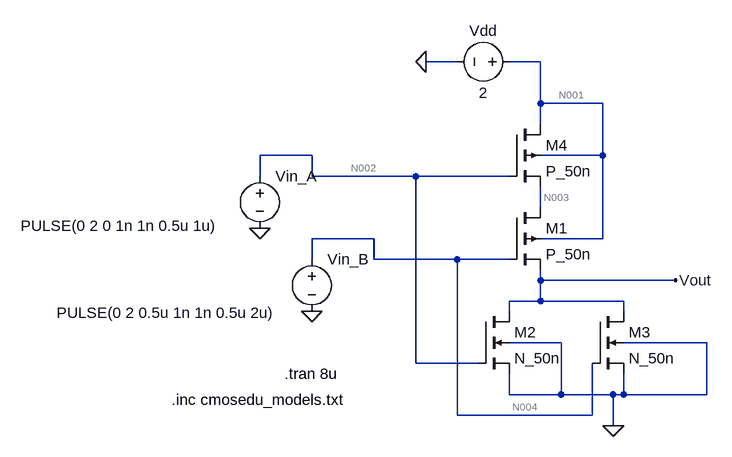
[diagram p0: schematic Draft4.asc]
Draft4.asc, the LTspice schematic file:
Version 4
SHEET 1 880 680
WIRE 112 -64 64 -64
WIRE 240 -64 192 -64
WIRE 240 0 240 -64
WIRE 336 0 240 0
WIRE 240 32 240 0
WIRE -112 80 -192 80
WIRE 336 80 336 0
WIRE 336 80 240 80
WIRE -192 112 -192 80
WIRE -112 112 -112 80
WIRE 48 112 -112 112
WIRE 192 112 48 112
WIRE 240 160 240 128
WIRE -16 208 -112 208
WIRE 336 208 336 80
WIRE 336 208 240 208
WIRE -112 240 -112 208
WIRE -16 240 -16 208
WIRE 112 240 -16 240
WIRE 192 240 112 240
WIRE 240 272 240 256
WIRE 448 272 240 272
WIRE 240 304 240 272
WIRE 240 304 192 304
WIRE 368 304 240 304
WIRE 192 320 192 304
WIRE 368 320 368 304
WIRE 272 368 192 368
WIRE 496 368 368 368
WIRE 48 400 48 112
WIRE 144 400 48 400
WIRE 192 448 192 416
WIRE 272 448 272 368
WIRE 272 448 192 448
WIRE 352 448 272 448
WIRE 368 448 368 416
WIRE 368 448 352 448
WIRE 496 448 496 368
WIRE 496 448 368 448
WIRE 112 480 112 240
WIRE 320 480 320 400
WIRE 320 480 112 480
WIRE 352 496 352 448
FLAG -112 320 0
FLAG -192 192 0
FLAG 64 -64 0
FLAG 352 496 0
FLAG 448 272 Vout
SYMBOL pmos4 192 160 R0
SYMATTR InstName M1
SYMATTR Value P_50n
SYMATTR Value2 l=50n w=1u
SYMBOL nmos4 144 320 R0
SYMATTR InstName M2
SYMATTR Value N_50n
SYMATTR Value2 l=50n w=0.5u
SYMBOL nmos4 320 320 R0
SYMATTR InstName M3
SYMATTR Value N_50n
SYMATTR Value2 l=50n w=0.5u
SYMBOL voltage -192 96 R0
WINDOW 3 -368 92 Left 2
WINDOW 123 0 0 Left 0
WINDOW 39 0 0 Left 0
SYMATTR InstName Vin_A
SYMATTR Value PULSE(0 2 0 1n 1n 0.5u 1u)
SYMBOL voltage -112 224 R0
WINDOW 3 -393 98 Left 2
WINDOW 123 0 0 Left 0
WINDOW 39 0 0 Left 0
SYMATTR InstName Vin_B
SYMATTR Value PULSE(0 2 0.5u 1n 1n 0.5u 2u)
SYMBOL voltage 208 -64 R90
WINDOW 0 -32 56 VBottom 2
WINDOW 3 32 56 VTop 2
WINDOW 123 0 0 Left 0
WINDOW 39 0 0 Left 0
SYMATTR InstName Vdd
SYMATTR Value 2
SYMBOL pmos4 192 32 R0
SYMATTR InstName M4
SYMATTR Value P_50n
SYMATTR Value2 l=50n w=1u
TEXT -154 416 Left 2 !.tran 8u
TEXT -328 456 Left 2 !.inc cmosedu_models.txt

The netlist it stands for:
* Draft4.asc
M1 N003 N004 Vout N001 P_50n l=50n w=1u
M2 Vout N002 0 0 N_50n l=50n w=0.5u
M3 Vout N004 0 0 N_50n l=50n w=0.5u
Vin_A N002 0 PULSE(0 2 0 1n 1n 0.5u 1u)
Vin_B N004 0 PULSE(0 2 0.5u 1n 1n 0.5u 2u)
Vdd N001 0 2
M4 N001 N002 N003 N001 P_50n l=50n w=1u
.model NMOS NMOS
.model PMOS PMOS
.lib standard.mos
.tran 8u
.inc cmosedu_models.txt
.backanno
.end

* Results of the author's LTspice run, read from the files saved beside the schematic
* Operating Point, zero values left out:
*   V(n003) = 1.969 V
*   V(vout) = 1.938 V
*   V(n001) = 2 V
*   Id(M3) = 11.75 µA
*   Ig(M3) = -34.95 nA
*   Ib(M3) = -11.71 µA
*   Is(M3) = -6.11 nA
*   Id(M2) = 11.75 µA
*   Ig(M2) = -34.95 nA
*   Ib(M2) = -11.71 µA
*   Is(M2) = -6.11 nA
*   Id(M4) = 24.42 µA
*   Ig(M4) = -2.838 µA
*   Ib(M4) = 2.358 µA
*   Is(M4) = -23.94 µA
*   Id(M1) = 23.94 µA
*   Ig(M1) = -2.401 µA
*   Ib(M1) = 1.963 µA
*   Is(M1) = -23.5 µA
*   I(Vdd) = -28.74 µA
*   I(Vin_b) = 2.436 µA
*   I(Vin_a) = 2.873 µA
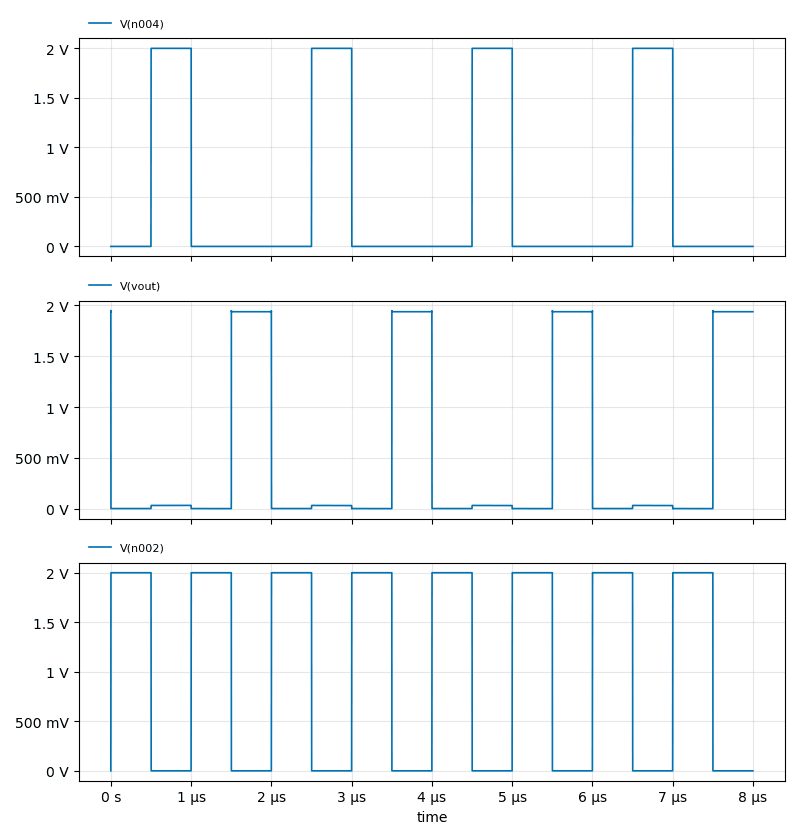
[diagram p1: Transient Analysis of Draft4.asc, plotted from the saved traces]
* Transient Analysis, 1 run:
*   V(n004): min 0 V, max 2 V, average 501 mV, rms 1.001 V, last 0 V
*   V(vout): min 229.2 µV, max 1.95 V, average 491.9 mV, rms 968.1 mV, last 1.938 V
*   V(n002): min 0 V, max 2 V, average 1.002 V, rms 1.415 V, last 0 V